# EAGLE design T&TV1.0 (EAGLE 9.3.1)

## Sheet 1 of 2
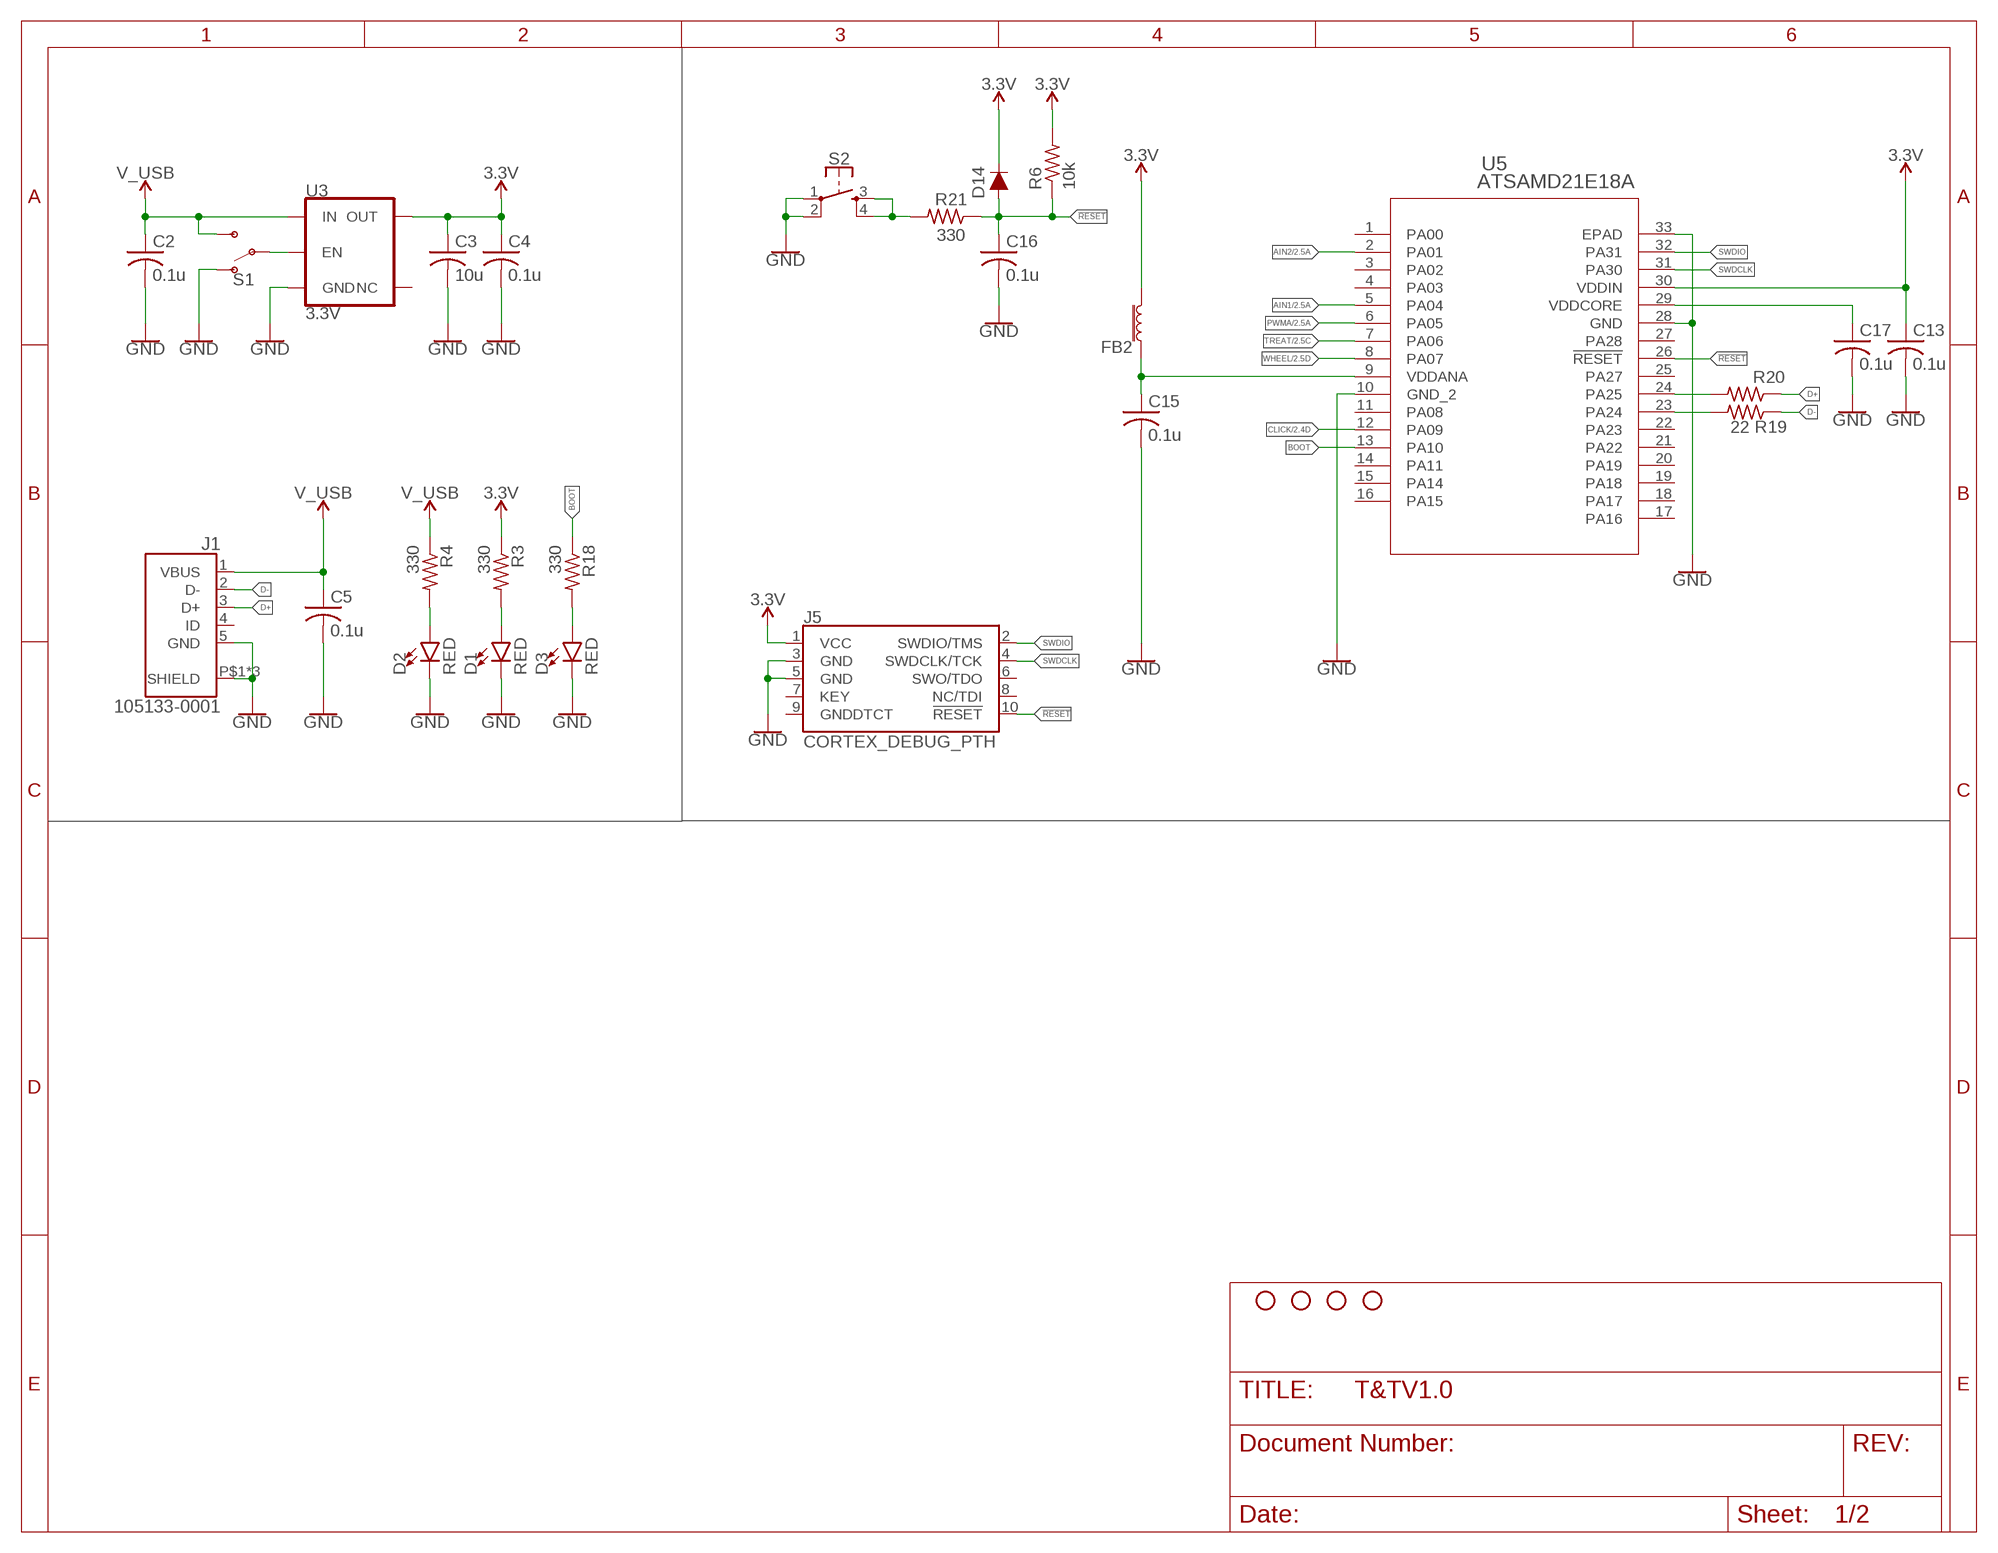
[diagram p0: schematic, sheet 1]

### Parts
C2  0.1u  C-USC0603K  [C0603K]
C3  10u  C-USC1206  [C1206]
C4  0.1u  C-USC0603K  [C0603K]
C5  0.1u  C-USC0603K  [C0603K]
C13  0.1u  C-USC0603K  [C0603K]
C15  0.1u  C-USC0603K  [C0603K]
C16  0.1u  C-USC0603K  [C0603K]
C17  0.1u  C-USC0603K  [C0603K]
D1  RED  LED-RED0603  [LED-0603]
D2  RED  LED-RED0603  [LED-0603]
D3  RED  LED-RED0603  [LED-0603]
D14  250mA/100V  DIODE-BAS16J  [SOD-323]
FB2  30Ω/1.8A  FERRITE_BEAD-0603  [0603]
H1  STAND-OFF  [STAND-OFF]
H2  STAND-OFF  [STAND-OFF]
H3  STAND-OFF  [STAND-OFF]
H4  STAND-OFF  [STAND-OFF]
J1  105133-0001  [MOLEX_105133-0001]
J5  CORTEX_DEBUG_PTH  [2X5-PTH-1.27MM]
R3  330  R-US_R0603  [R0603]
R4  330  R-US_R0603  [R0603]
R6  10k  R-US_R0603  [R0603]
R18  330  R-US_R0603  [R0603]
R19  22  R-US_R0603  [R0603]
R20  22  R-US_R0603  [R0603]
R21  330  R-US_R0603  [R0603]
S1  SWITCH-SPDT-SMD-RIGHT-ANGLE  [SWITCH_SPST_SMD_A]
S2  MOMENTARY-SWITCH-SPST-2-SMD-5.2MM  [TACTILE_SWITCH_SMD_5.2MM]
U3  3.3V  V_REG_AP2112K-3.3V  [SOT23-5]
U5  ATSAMD21E18A  ATSAMD21E18A-MUT  [QFN32_5X5MC]

### Nets
3.3V: C3.1 C4.1 C13.1 D14.C FB2.2 J5.1(VCC) R3.1 R6.2 U3.5(OUT) U5.30(VDDIN) ; also sheet 2
!RESET: C16.1 D14.A J5.10(!RESET) R6.1 R21.1 U5.26(!RESET)
AIN1: U5.5(PA04) ; also sheet 2
AIN2: U5.2(PA01) ; also sheet 2
BOOT: R18.1 U5.13(PA10)
CLICK: U5.12(PA09) ; also sheet 2
D+: J1.3(D+) R20.1
D-: J1.2(D-) R19.1
GND: C2.2 C3.2 C4.2 C5.2 C13.2 C15.2 C16.2 C17.2 D1.C D2.C D3.C J1.5(GND) J1.P$1(SHIELD) J1.P$2(SHIELD) J1.P$3(SHIELD) J5.3(GND) J5.5(GND) S1.1(O) S2.1 S2.2 U3.2(GND) U5.10(GND_2) U5.28(GND) U5.33(EPAD) ; also sheet 2
N$1: D1.A R3.2
N$4: C15.1 FB2.1 U5.9(VDDANA)
N$11: C17.1 U5.29(VDDCORE)
N$14: D2.A R4.2
N$17: D3.A R18.2
N$32: R20.2 U5.24(PA25)
N$33: R19.2 U5.23(PA24)
N$34: R21.2 S2.3 S2.4
N$35: S1.2(P) U3.3(EN)
PWMA: U5.6(PA05) ; also sheet 2
SWDCLK: J5.4(SWDCLK/TCK) U5.31(PA30)
SWDIO: J5.2(SWDIO/TMS) U5.32(PA31)
TREAT: U5.7(PA06) ; also sheet 2
V_USB: C2.1 C5.1 J1.1(VBUS) R4.1 S1.3(S) U3.1(IN) ; also sheet 2
WHEEL: U5.8(PA07) ; also sheet 2
Unconnected: J1.4(ID) J5.6(SWO/TDO) J5.7(KEY) J5.8(NC/TDI) J5.9(GNDDTCT) U3.4(NC) U5.1(PA00) U5.3(PA02) U5.4(PA03) U5.11(PA08) U5.14(PA11) U5.15(PA14) U5.16(PA15) U5.17(PA16) U5.18(PA17) U5.19(PA18) U5.20(PA19) U5.21(PA22) U5.22(PA23) U5.25(PA27) U5.27(PA28)

## Sheet 2 of 2
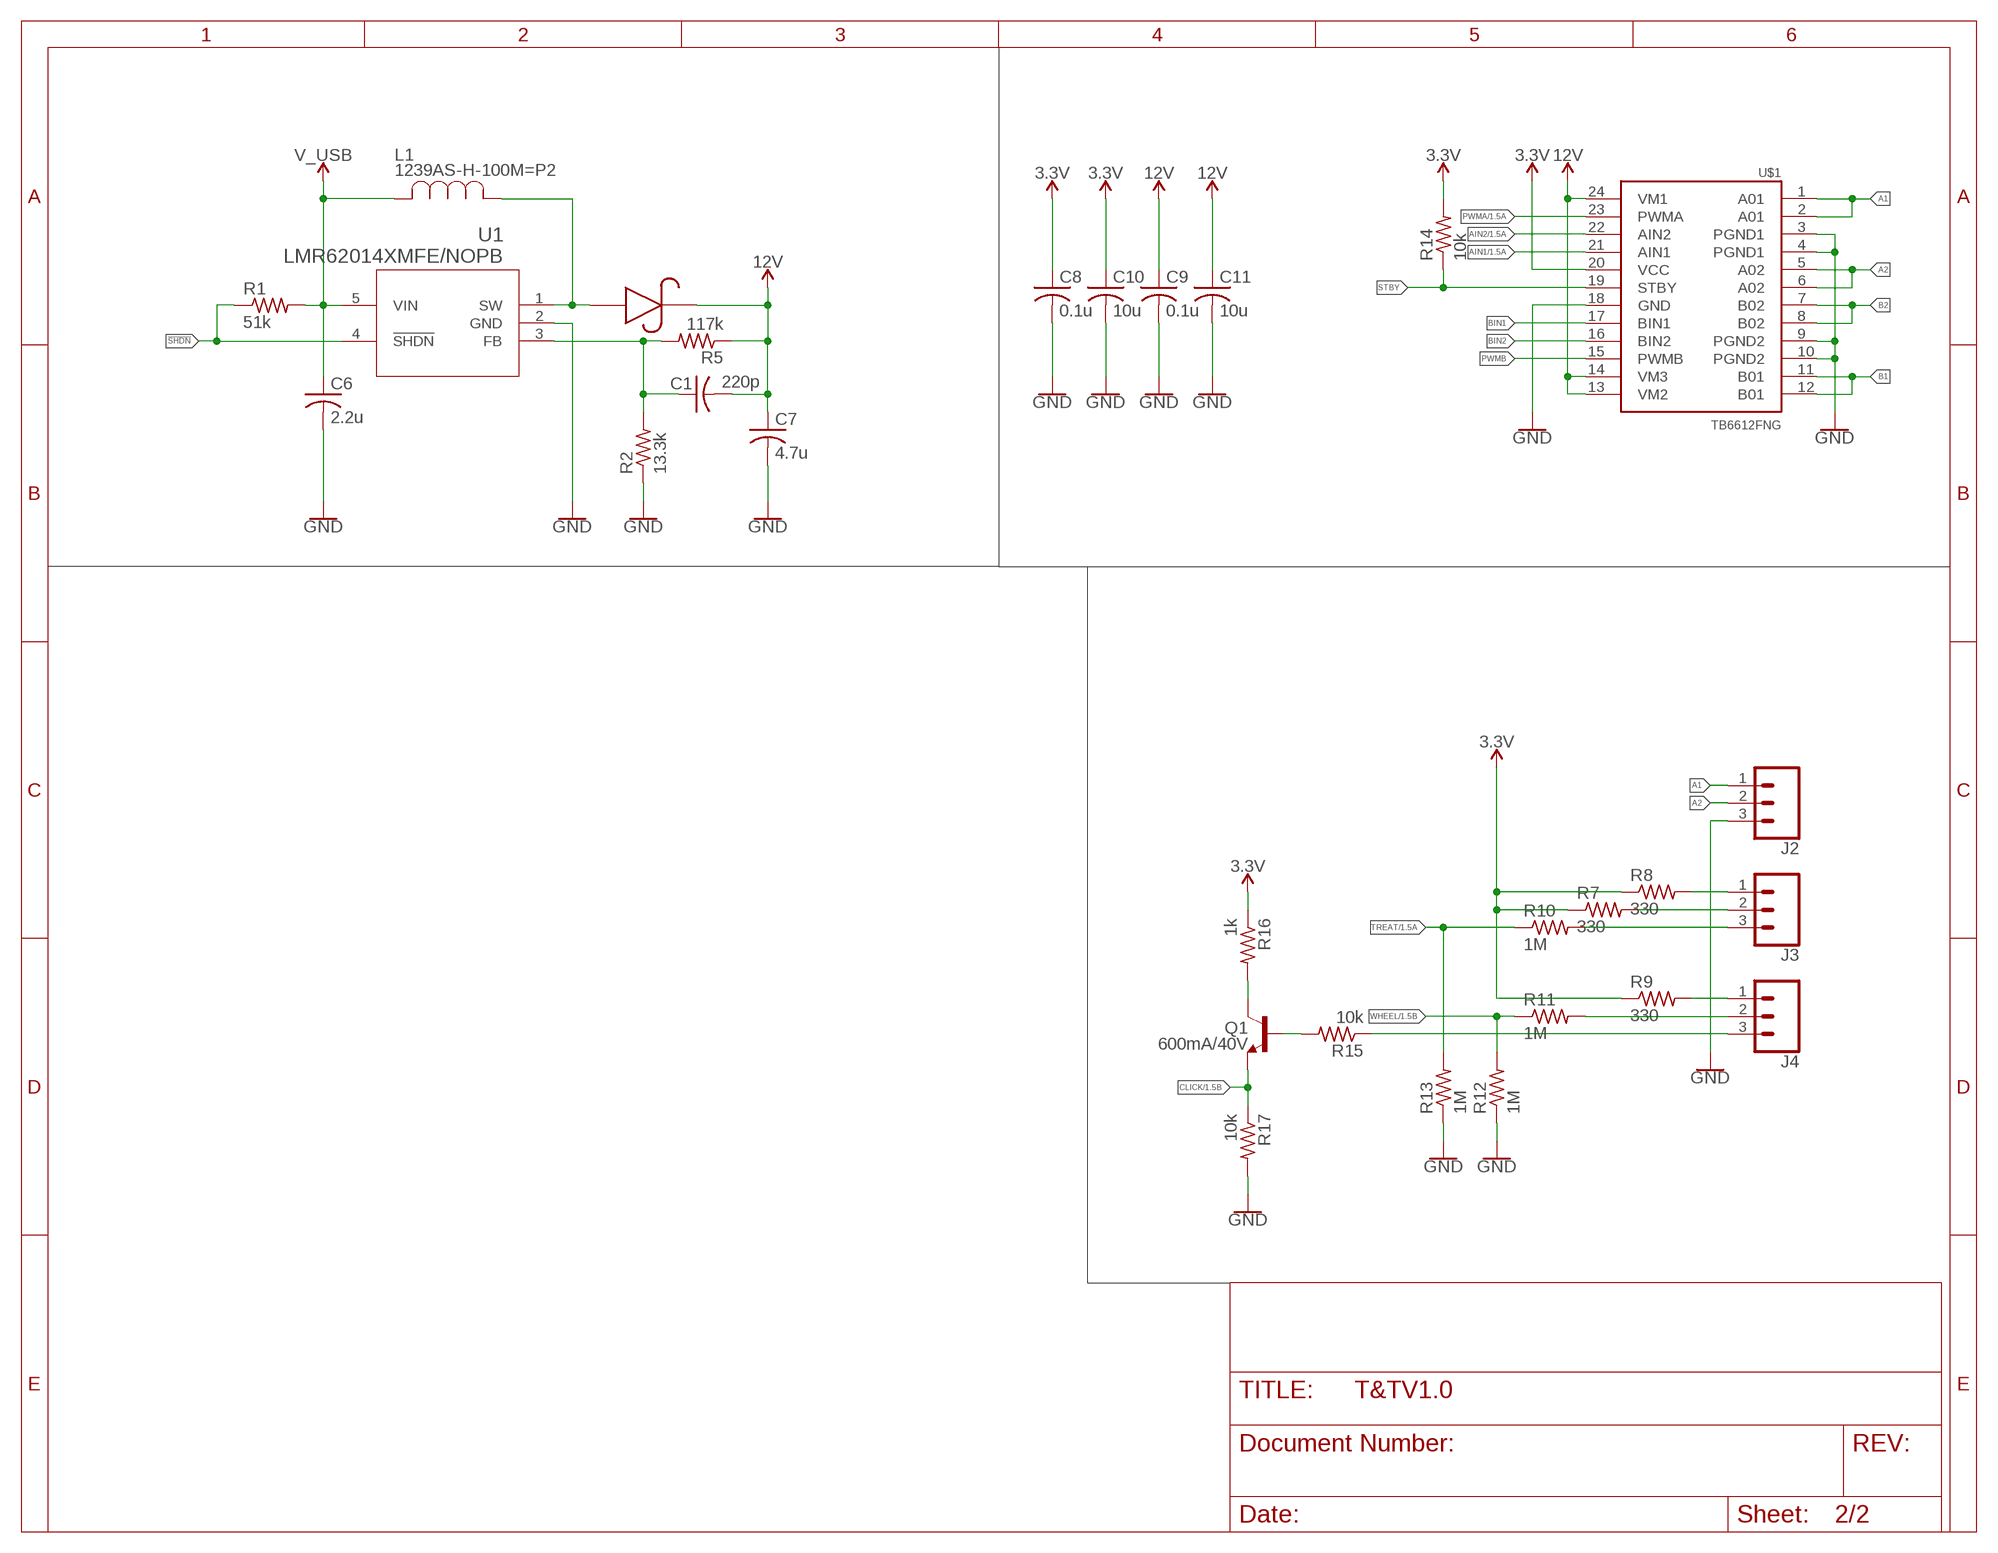
[diagram p1: schematic, sheet 2]

### Parts
C1  220p  C-USC0603  [C0603]
C6  2.2u  C-USC0603  [C0603]
C7  4.7u  C-USC0603  [C0603]
C8  0.1u  C-USC0603  [C0603]
C9  0.1u  C-USC0603  [C0603]
C10  10u  C-USC1206  [C1206]
C11  10u  C-USC1206  [C1206]
J2  CONN_03SCREW-NS  [SCREWTERMINAL-3.5MM-3-NS]
J3  CONN_03SCREW-NS  [SCREWTERMINAL-3.5MM-3-NS]
J4  CONN_03SCREW-NS  [SCREWTERMINAL-3.5MM-3-NS]
L1  1239AS-H-100M=P2  [IND_DFE252012C]
Q1  600mA/40V  TRANS_NPN-MMBT2222AL  [SOT23-3]
R1  51k  R-US_R0603  [R0603]
R2  13.3k  R-US_R0603  [R0603]
R5  117k  R-US_R0603  [R0603]
R7  330  R-US_R0603  [R0603]
R8  330  R-US_R0603  [R0603]
R9  330  R-US_R0603  [R0603]
R10  1M  R-US_R0603  [R0603]
R11  1M  R-US_R0603  [R0603]
R12  1M  R-US_R0603  [R0603]
R13  1M  R-US_R0603  [R0603]
R14  10k  R-US_R0603  [R0603]
R15  10k  R-US_R0603  [R0603]
R16  1k  R-US_R0603  [R0603]
R17  10k  R-US_R0603  [R0603]
U1  LMR62014XMFE/NOPB  [MF05A]
U4  MBR0520  MBR0520LT1G  [SOD-123]
U$1  TB6612FNG  [SSOP24]

### Nets
3.3V: C8.1 C10.1 R7.1 R8.1 R9.1 R14.2 R16.1 U$1.20(VCC) ; also sheet 1
12V: C1.2 C7.1 C9.1 C11.1 R5.1 U4.2 U$1.13(VM2) U$1.14(VM3) U$1.24(VM1)
!SHDN: R1.1 U1.4(!SHDN)
A1: J2.1 U$1.1(A01) U$1.2(A01)
A2: J2.2 U$1.5(A02) U$1.6(A02)
AIN1: U$1.21(AIN1) ; also sheet 1
AIN2: U$1.22(AIN2) ; also sheet 1
B1: U$1.11(B01) U$1.12(B01)
B2: U$1.7(B02) U$1.8(B02)
BIN1: U$1.17(BIN1)
BIN2: U$1.16(BIN2)
CLICK: Q1.2(E) R17.1 ; also sheet 1
GND: C6.2 C7.2 C8.2 C9.2 C10.2 C11.2 J2.3 R2.1 R12.1 R13.1 R17.2 U1.2(GND) U$1.3(PGND1) U$1.4(PGND1) U$1.9(PGND2) U$1.10(PGND2) U$1.18(GND) ; also sheet 1
N$2: Q1.1(B) R15.2
N$3: L1.1 U1.1(SW) U4.1
N$5: J3.1 R8.2
N$6: J3.2 R7.2
N$9: C1.1 R2.2 R5.2 U1.3(FB)
N$10: J4.1 R9.2
N$12: J3.3 R10.2
N$13: Q1.3(C) R16.2
N$15: J4.2 R11.2
N$16: J4.3 R15.1
PWMA: U$1.23(PWMA) ; also sheet 1
PWMB: U$1.15(PWMB)
STBY: R14.1 U$1.19(STBY)
TREAT: R10.1 R13.2 ; also sheet 1
V_USB: C6.1 L1.2 R1.2 U1.5(VIN) ; also sheet 1
WHEEL: R11.1 R12.2 ; also sheet 1

## Library data of the parts
C1-C11 C13 C15-C17 = adafruit:C-US: CAPACITOR, American symbol
D1-D3 = SparkFun-LED:LED-RED: Red SMD LED Used in manufacturing of most products at SparkFun Packages: 0603 - SMD 0603 package [Product Link] <http://docs.avagotech.com/docs/AV02-0551EN> 0603 SMART - SMD 0603 SMART package ( more efficient and expensive)[Product Link] <http://www.osram-os.com/Graphics/XPic2/00077099_0.pdf> 1206 - SMD1206 package [Product Link] <https://www.sparkfun.com/datasheets/DevTools/LilyPad/Q150OVS4.pdff> SparkFun Products: Pro Mini 328 -5V <https://www.sparkfun.com/products/821> RedBoard <https://www.sparkfun.com/products/12757> IOIO-OTG <https://www.sparkfun.com/products/13613>; PROD_ID: DIO-00819
D14 = SparkFun-DiscreteSemi:DIODE: Diode These are standard reverse protection diodes and small signal diodes. SparkFun Products: SparkFun SparkPunk Sound Kit <https://www.sparkfun.com/products/11177> SparkFun ESP8266 Thing <https://www.sparkfun.com/products/13231>; PROD_ID: DIO-09646
FB2 = SparkFun-Coils:FERRITE_BEAD: Ferrite Bead (blocks, cores, rings, chokes, etc.) Inductor with layers of ferrite used to suppress high frequencies. Often used to isolate high frequency noise. SparkFun Products: IOIO-OTG - V2.2 <https://www.sparkfun.com/products/13613> SparkFun SAMD21 Mini Breakout <https://www.sparkfun.com/products/13664> SparkFun 6 Degrees of Freedom Breakout - LSM6DS3 <https://www.sparkfun.com/products/13339> SparkFun SAMD21 Dev Breakout <https://www.sparkfun.com/products/13672>; PROD_ID: NDUC-13805
H1-H4 = SparkFun-Hardware:STAND-OFF: Stand Off Drill holes for mechanically mounting via screws, standoffs, etc. Note: Use the keepout ring to avoid running the screw head into surrounding components. Variant Overviews STAND-OFF - Mechanical footprint for a #4 phillips button head screw. STAND-OFF-TIGHT - Mechanical footprint for a #4 phillips button head screw, Example SparkFun Products Screw - Phillips Head (1/4", 4-40, 10 pack) <https://www.sparkfun.com/products/10453> (PRT-10453) Screw - Phillips Head (1/2", 4-40, 10 pack) <https://www.sparkfun.com/products/10452> (PRT-10452) Screw - Phillips Head (3/4", 4-40, 10 pack) <https://www.sparkfun.com/products/10451> (PRT-10451) Screw - Phillips Head (1", 4-40, 10 pack) <https://www.sparkfun.com/products/10450> (PRT-10450)
J1 = VertUSB105133-0001:105133-0001: Conn Micro USB Type B RCP 5 POS 0.65mm Solder RA SMD 5 Terminal 1 Port Embossed T/R; DESCRIPTION: USB - micro B USB 2.0 Receptacle Connector 5 Position Surface Mount; DIGI-KEY_PART_NUMBER: WM9734CT-ND; DIGI-KEY_PURCHASE_URL: https://www.digikey.com/product-detail/en/molex/1051330001/WM9734CT-ND/4037910?utm_source=snapeda&utm_medium=aggregator&utm_campaign=symbol; MF: Molex; MP: 1051330001; PACKAGE: None
J2-J4 = SparkFun-Connectors:CONN_03: Multi connection point. Often used as Generic Header-pin footprint for 0.1 inch spaced/style header connections On any of the 0.1 inch spaced packages, you can populate with these: Break Away Headers - Straight <https://www.sparkfun.com/products/116> (PRT-00116) Break Away Male Headers - Right Angle <https://www.sparkfun.com/products/553> (PRT-00553) Female Headers <https://www.sparkfun.com/products/115> (PRT-00115) Break Away Headers - Machine Pin <https://www.sparkfun.com/products/117> (PRT-00117) Break Away Female Headers - Swiss Machine Pin <https://www.sparkfun.com/products/743> (PRT-00743) Stackable Header - 3 Pin (Female, 0.1") <https://www.sparkfun.com/products/13875> (PRT-13875) For SCREWTERMINALS and SPRING TERMINALS visit here: Screw Terimnals on SparkFun.com <https://www.sparkfun.com/search/results?term=Screw+Terminals> (5mm/3.5mm/2.54mm spacing) This device is also useful as a general connection point to wire up your design to another part of your project. Our various solder wires solder well into these plated through hole pads. Hook-Up Wire - Assortment (Stranded, 22 AWG) <https://www.sparkfun.com/products/11375> (PRT-11375) Hook-Up Wire - Assortment (Solid Core, 22 AWG) <https://www.sparkfun.com/products/11367> (PRT-11367) View the entire wire category on our website here <https://www.sparkfun.com/categories/141> Special notes: Molex polarized connector foot print use with SKU : PRT-08232 with associated crimp pins and housings.
J5 = SparkFun-Connectors:CORTEX_DEBUG: Cortex Debug Connector - 10 pin Supports JTAG debug, Serial Wire debug, and Serial Wire Viewer. PTH and SMD connector options available. General Connector Information <http://infocenter.arm.com/help/topic/com.arm.doc.faqs/attached/13634/cortex_debug_connectors.pdf> Products: PTH Connector <http://www.digikey.com/product-detail/en/cnc-tech/3220-10-0100-00/1175-1627-ND/3883661> -via Digi-Key SparkFun PSoc <https://www.sparkfun.com/products/13229> SparkFun T <https://www.sparkfun.com/products/13810>
L1 = 1239AS-H-100M=P2:1239AS-H-100M=P2; BUILT_BY: EMA_Justin; COPYRIGHT: Copyright (C) 2016 Accelerated Designs. All rights reserved; MANUFACTURER_PART_NUMBER: 1239AS-H-100M=P2; VENDOR: Murata
Q1 = SparkFun-DiscreteSemi:TRANS_NPN: NPN transistor Current controlled devices typically used to amplify current or used as a switch. BC547 - COM-08928 <http://www.sparkfun.com/products/8928> (TO-92 45V 100mA) (1.Collector 2.Base 3.Emitter) 2N3904 - COM-00521 <http://www.sparkfun.com/products/521> (TO-92 40V 200mA) (1.Emitter 2.Base 3.Collector) P2N2222A - COM-12852 <http://www.sparkfun.com/products/12852> (TO-92 40V 600mA) (1.Collector 2.Base 3.Emitter); PROD_ID: TRANS-08049
R1-R21 = adafruit:R-US_: RESISTOR, American symbol
S1 = SparkFun-Switches:SWITCH-SPDT: Single Pole, Double Throw (SPDT) Switch Single-pole, double-throw (SPDT) switch. Variant Overview SMD-AYZ0202 Surface Mount DPDT Switch <https://www.sparkfun.com/products/597> (COM-00597) Used on e.g. LilyPad Arduino USB - ATmega32U4 Board <https://www.sparkfun.com/products/12049> PTH-11.6X4.0MM SPDT Mini Power Switch <https://www.sparkfun.com/products/102> (COM-00102) Used on e.g. SparkFun Simon Says - Through-Hole Soldering Kit <https://www.sparkfun.com/products/10547> (KIT-10547) PTH-11.6X4.0MM-KIT KIT version of SPDT Mini Power Switch - Simplifies soldering by removing tStop of switch pins - only one side can be soldered. PTH-11.6X4.0MM-LOCK LOCK version of SPDT Mini Power Switch - Offset pins hold switch in place for easier soldering. SMD-RIGHT-ANGLE Surface Mount Right Angle Switch <https://www.sparkfun.com/products/10860> (COM-10860) Used on e.g. SparkFun ESP8266 Thing <https://www.sparkfun.com/products/13231>; PROD_ID: SWCH-10651; SF_SKU: COM-10860
S2 = SparkFun-Switches:MOMENTARY-SWITCH-SPST-2: Momentary Switch (Pushbutton) - SPST - Two Circuits Normally-open (NO) SPST momentary switches (buttons, pushbuttons). Schematic symbol includes two switch circuits. Variants SMD-4.6MMX2.8MM - 4.60mm x 2.80mm Tactile Momentary Button Switch - Used on SparkFun SAMD21 Mini Breakout <https://www.sparkfun.com/products/13664> SMD-5.2MM - Mini Pushbutton Switch - SMD <https://www.sparkfun.com/products/8720> - Used on Arduino Pro Mini <https://www.sparkfun.com/products/11114>; PROD_ID: SWCH-08247; SF_SKU: COM-08720
U1 = LMR62014:LMR62014XMFE/NOPB; BUILT_BY: EMA_UL_Team; MANUFACTURER: Texas Instruments; MANUFACTURER_PART_NUMBER: LMR62014XMFE/NOPB; VENDOR: National Semiconductor
U3 = SparkFun-IC-Power:V_REG_AP2112: AP2112 - 600mA CMOS LDO Regulator w/ Enable The AP2112 is CMOS process low dropout linear regulator with enable function, the regulator delivers a guaranteed 600mA (min.) continuous load current. Features Output Voltage Accuracy: ±1.5% Output Current: 600mA (Min.) Foldback Short Current Protection: 50mA Enable Function to Turn ON/OFF VOUT Low Dropout Voltage (3.3V): 250mV (Typ.) @IOUT=600mA Excellent Load Regulation: 0.2%/A (Typ.) Excellent Line Regulation: 0.02%/V (Typ.) Low Quiescent Current: 55μA (Typ.) Low Standby Current: 0.01μA (Typ.) Low Output Noise: 50μVRMS PSRR: 100Hz -65dB, 1kHz -65dB OTSD Protection Stable with 1.0μF Flexible Cap: Ceramic, Tantalum and Aluminum Electrolytic Operation Temperature Range: -40°C to 85°C ESD: MM 400V, HBM 4000V; PROD_ID: VREG-12457
U4 = MBR0520LT1G:MBR0520LT1G; BUILT_BY: EMA_UL_Team; MANUFACTURER_PART_NUMBER: MBR0520LT1G; VENDOR: ON Semiconductor
U5 = ATSAMD21E18A-MUT:ATSAMD21E18A-MUT; BUILT_BY: EMA_Molly; COPYRIGHT: Copyright (C) 2018 Accelerated Designs. All rights reserved; MANUFACTURER_PART_NUMBER: ATSAMD21E18A-MUT; VENDOR: Microchip
U$1 = SparkFun-IC-Special-Function:TB6612FNG: Toshiba 1A dual motor driver IC-09363; PROD_ID: IC-09363

## Board
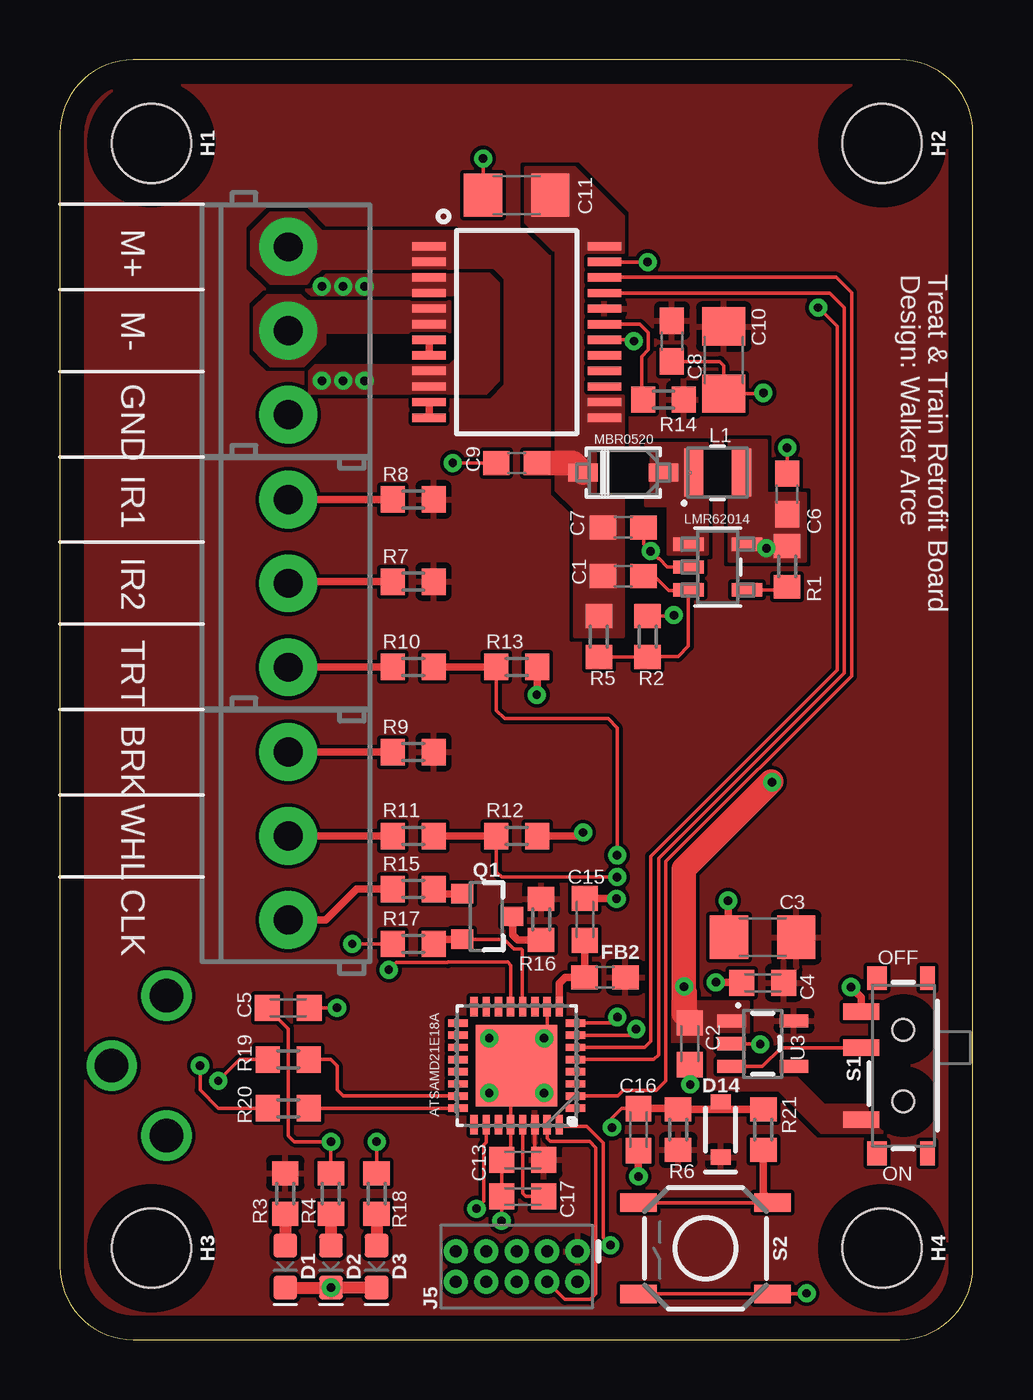
[diagram p2: board, top side]
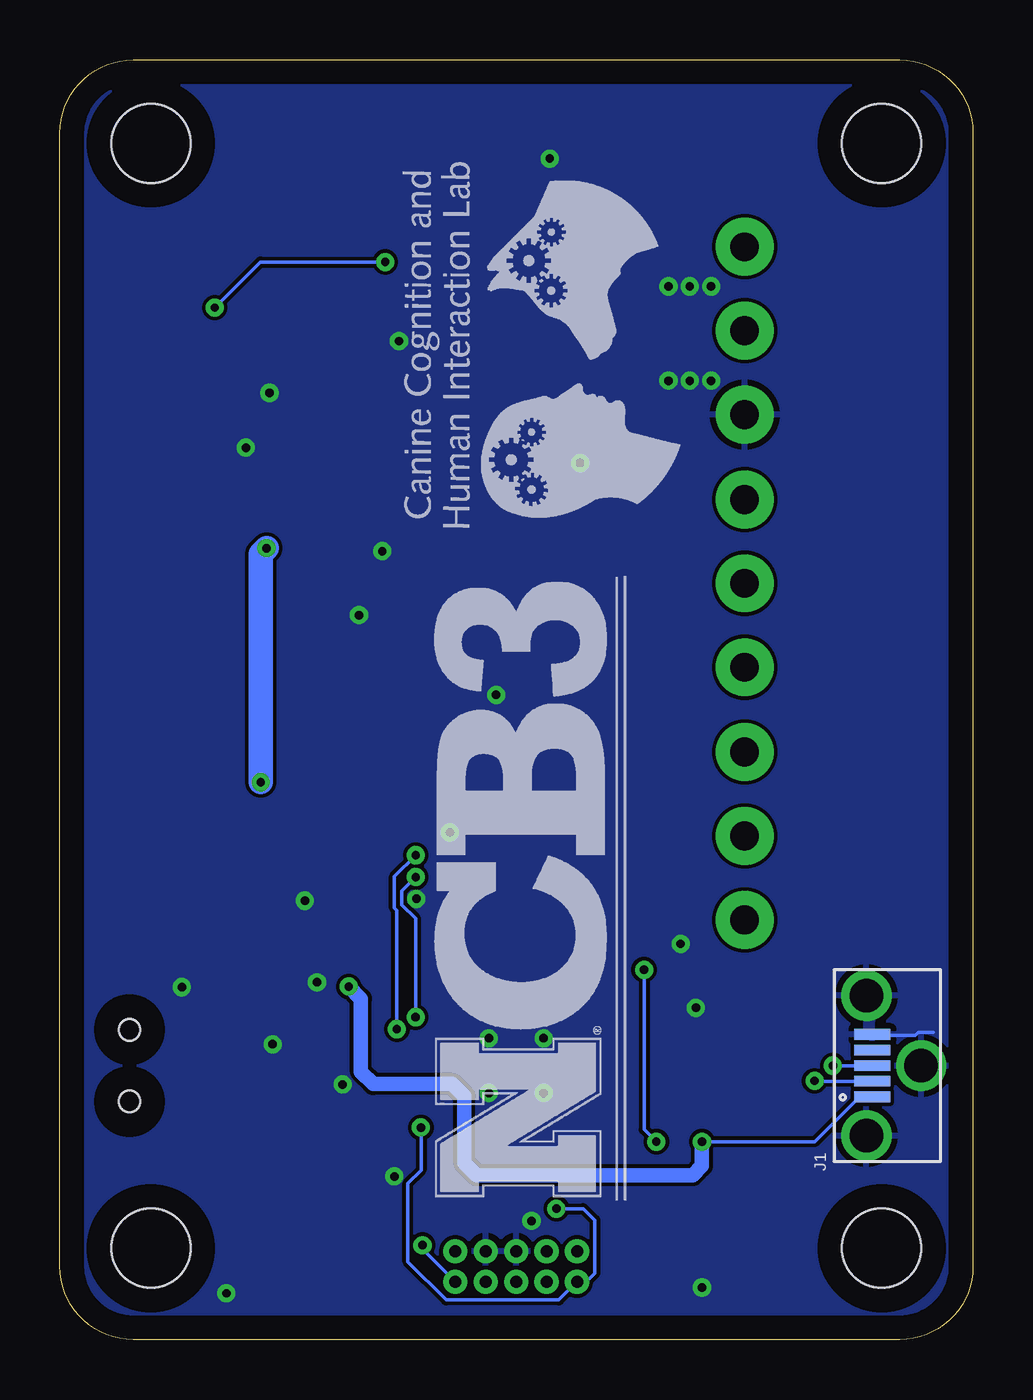
[diagram p3: board, bottom side, seen from below]

Size 38.08 x 53.39 mm. Coordinates in mm from the lower left corner, seen from the top.
Outline: 0,50.34 0,3.05 arc90 3.05,0 35.03,0 arc90 38.08,3.05 38.08,50.34 arc90 35.03,53.39 3.05,53.39 arc90 0,50.34
Copper layers (1*16): Top 0.035mm / dielectric 1.5mm / Bottom 0.035mm
Design rules "default": minimum track width 6mil, minimum drill 0.35mm, track to track 6mil, track to pad 6mil, pad to pad 6mil, via to via 6mil, smd to smd 6mil, copper to edge 40mil, drill to drill 6mil, minimum pad ring 10mil, minimum via ring 8mil, stop-mask expansion 4mil, vias tented up to drill 0mil, thermal gap 10mil

### Footprints (pad centres in the part's own frame; a part is rotated, then mirrored left to right if it is on the bottom)
C0603 = smd 1.1 x 1: 1 -0.85,0; 2 0.85,0
C0603K = smd 1.05 x 1.08: 1 -0.875,0; 2 0.875,0
C1206 = smd 1.6 x 1.8: 1 -1.4,0; 2 1.4,0
LED-0603 = smd 1 x 1: A -0.877,0; C 0.877,0
SOD-323 = smd 0.63 x 0.83: A 1.15,0; C -1.15,0
0603 = smd 1.1 x 1: 1 -0.85,0; 2 0.85,0
STAND-OFF = hole 3.302: 0,0
MOLEX_105133-0001 = smd 0.45 x 1.5: 1 -1.3,-0.25; 2 -0.65,-0.25; 3 0,-0.25; 4 0.65,-0.25; 5 1.3,-0.25 | drill 1.4: P$1 0,-2.286; P$2 -2.921,0; P$3 2.921,0
SCREWTERMINAL-3.5MM-3-NS = drill 1.2 pad 2.413: 1 0,0; 2 3.5,0; 3 7,0
2X5-PTH-1.27MM = drill 0.508 pad 1: 1 -2.54,-0.635; 2 -2.54,0.635; 3 -1.27,-0.635; 4 -1.27,0.635; 5 0,-0.635; 6 0,0.635; 7 1.27,-0.635; 8 1.27,0.635; 9 2.54,-0.635; 10 2.54,0.635
IND_DFE252012C = smd 0.8 x 2.007: 1 -0.997,0; 2 0.997,0
SOT23-3 = smd 0.8 x 0.9: 1 -0.95,-1; 2 0.95,-1; 3 0,1.1
R0603 = smd 1 x 1.1: 1 -0.85,0; 2 0.85,0
SWITCH_SPST_SMD_A = smd 0.7 x 1.5: 1 -2.25,-1.75; 2 -0.75,-1.75; 3 2.25,-1.75 | smd 1 x 0.6: GND1 -3.65,1; GND3 3.65,1 | smd 1 x 0.8: GND2 -3.65,-1.1; GND4 3.65,-1.1 | hole 0.9: -1.5,0; 1.5,0
TACTILE_SWITCH_SMD_5.2MM = smd 1.524 x 0.762: 1 -2.794,1.905; 2 2.794,1.905; 3 -2.794,-1.905; 4 2.794,-1.905
MF05A = smd 1.27 x 0.559: 1 -1.219,0.953; 2 -1.219,0; 3 -1.219,-0.953; 4 1.219,-0.953; 5 1.219,0.953
SOT23-5 = smd 0.55 x 1.2: 1 -0.95,-1.3; 2 0,-1.3; 3 0.95,-1.3; 4 0.95,1.3; 5 -0.95,1.3
SOD-123 = smd 1.219 x 0.762: 1 -1.676,0; 2 1.676,0
QFN32_5X5MC = smd 0.813 x 0.305: 1 -2.451,1.778; 2 -2.451,1.27; 3 -2.451,0.762; 4 -2.451,0.254; 5 -2.451,-0.254; 6 -2.451,-0.762; 7 -2.451,-1.27; 8 -2.451,-1.778; 17 2.451,-1.778; 18 2.451,-1.27; 19 2.451,-0.762; 20 2.451,-0.254; 21 2.451,0.254; 22 2.451,0.762; 23 2.451,1.27; 24 2.451,1.778 | smd 0.305 x 0.813: 9 -1.778,-2.451; 10 -1.27,-2.451; 11 -0.762,-2.451; 12 -0.254,-2.451; 13 0.254,-2.451; 14 0.762,-2.451; 15 1.27,-2.451; 16 1.778,-2.451; 25 1.778,2.451; 26 1.27,2.451; 27 0.762,2.451; 28 0.254,2.451; 29 -0.254,2.451; 30 -0.762,2.451; 31 -1.27,2.451; 32 -1.778,2.451 | smd 3.404 x 3.404: 33 0,0
SSOP24 = smd 0.348 x 1.397: 1 -3.575,-3.656; 2 -2.925,-3.656; 3 -2.275,-3.656; 4 -1.625,-3.656; 5 -0.975,-3.656; 6 -0.325,-3.656; 7 0.325,-3.656; 8 0.975,-3.656; 9 1.625,-3.656; 10 2.275,-3.656; 11 2.925,-3.656; 12 3.575,-3.656; 13 3.575,3.656; 14 2.925,3.656; 15 2.275,3.656; 16 1.625,3.656; 17 0.975,3.656; 18 0.325,3.656; 19 -0.325,3.656; 20 -0.975,3.656; 21 -1.625,3.656; 22 -2.275,3.656; 23 -2.925,3.656; 24 -3.575,3.656

### Placement (x,y rotation side)
C1  23.5,31.85 180 top
C2  26.26,12.34 270 top
C3  29.31,16.79 180 top
C4  29.31,14.88 180 top
C5  9.53,13.84 0 top
C6  30.33,35.28 90 top
C7  23.5,33.88 0 top
C8  25.53,41.66 270 top
C9  19.05,36.58 180 top
C10  27.69,40.87 270 top
C11  19.05,47.75 180 top
C13  19.3,7.49 180 top
C15  21.89,17.53 90 top
C16  24.13,8.76 270 top
C17  19.3,5.97 180 top
D1  9.4,3.05 270 top
D2  11.3,3.05 270 top
D3  13.21,3.05 270 top
D14  27.56,8.76 90 top
FB2  22.73,15.11 0 top
H1  3.81,49.91 270 top
H2  34.29,49.91 270 top
H3  3.81,3.81 270 top
H4  34.29,3.81 270 top
J1  4.45,11.43 90 bottom
J2  9.53,45.59 270 top
J3  9.53,35.05 270 top
J4  9.53,24.51 270 top
J5  19.05,3.05 180 top
L1  27.43,36.17 0 top
Q1  17.78,17.65 270 top
R1  30.33,32.26 90 top
R2  24.51,29.34 270 top
R3  9.4,6.1 270 top
R4  11.3,6.1 270 top
R5  22.48,29.34 270 top
R6  25.78,8.76 270 top
R7  14.73,31.62 180 top
R8  14.73,35.05 180 top
R9  14.73,24.51 180 top
R10  14.73,28.07 180 top
R11  14.73,21.01 180 top
R12  19.05,21.01 180 top
R13  19.05,28.07 180 top
R14  25.17,39.22 0 top
R15  14.73,18.8 0 top
R16  20.07,17.53 270 top
R17  14.73,16.51 180 top
R18  13.21,6.1 270 top
R19  9.53,11.68 0 top
R20  9.53,9.65 0 top
R21  29.34,8.76 270 top
S1  35.18,11.43 270 top
S2  26.92,3.81 180 top
U1  27.43,32.23 0 top
U3  29.31,12.34 270 top
U4  23.5,36.17 180 top
U5  19.05,11.43 180 top
U$1  19.05,42.04 270 top

### Tracks (layer width: path | path; a pad name or v marks a point on that pad's centre or on a via)
3.3V
  Top 0.152: U5.30 19.81,7.86 C13.1
  pour Top (rank 3): 0,53.34 0,0 38.1,0 38.1,53.34
12V
  Top 1.016: C9.1 21.41,36.58 U4.2
  pour Top (no thermals): 23.5,29.34 21.46,29.34 21.46,34.67 20.7,35.43 20.7,45.97 23.5,45.97 23.5,45.34 21.84,45.34 21.84,39.37 23.5,39.37
  pour Top (no thermals): 19.43,48.9 19.43,46.61 20.57,45.47 23.5,45.47 23.5,46.86 21.46,48.9
!RESET  (via drill 0.35)
  Top 0.152: U5.26 17.78,8.23 17.68,8.13 17.68,5.76 v17.37,5.46 | v23.02,8.85 23.02,9.23 23.43,9.64 C16.1
  Top 0.305: C16.1 25.78,9.64 R6.1 27.56,9.61 | 27.56,9.61 R21.1 | D14.A 27.56,9.61
  Bottom 0.152: v17.37,5.46 16.26,5.46 15.77,4.98 15.77,2.77 16.13,2.41 J5.10 17.27,1.65 21.97,1.65 23.57,3.25 23.57,6.51 23.02,7.06 v23.02,8.84 v23.02,8.85
!SHDN
  Top 0.152: U1.4 30.2,31.28 R1.1
A1
  pour Top (no thermals): 10.16,46.99 8.76,46.99 8,46.23 8,44.83 8.76,44.07 10.29,44.07 10.92,44.7 16.38,44.7 16.38,46.23 10.92,46.23
A2
  pour Top (no thermals): 16.26,43.31 10.29,43.31 10.03,43.56 9.02,43.56 8.64,43.56 8.13,43.05 8.13,41.27 8.51,40.89 8.76,40.64 10.16,40.64 11.05,41.53 11.05,41.91 11.05,42.04 16.26,42.04
AIN1
  Top 0.152: U5.5 24.77,11.68 24.97,11.89 24.97,20.07 32.72,27.81 32.72,43.05 32.11,43.66 U$1.21
AIN2
  Top 0.152: U5.2 23.26,10.16 23.5,10.39 24.87,10.39 25.27,10.79 25.27,19.94 33.02,27.69 33.02,43.69 32.38,44.32 22.72,44.32 U$1.22
B1
  Top 0.305: U$1.11 U$1.12
B2
  Top 0.305: U$1.7 U$1.8
BOOT  (via drill 0.35)
  Top 0.152: U5.13 18.8,15.62 18.67,15.75 16.19,15.75 16.18,15.73 14.02,15.73 v13.72,15.43 | v13.21,8.26 R18.1
  Bottom 0.152: v13.72,15.43 13.72,8.76 v13.21,8.26
CLICK
  Top 0.152: Q1.2 18.52,16.7 18.93,16.3 19.25,16.3 19.29,16.26 19.29,13.9 U5.12
  Top 0.305: Q1.2 15.78,16.7 R17.1
D+  (via drill 0.35)
  Top 0.152: v5.84,11.43 5.84,10.41 6.6,9.65 R20.1
  Bottom 0.152: J1.3 v5.84,11.43
D-  (via drill 0.35)
  Top 0.152: v6.6,10.79 7.49,11.68 R19.1
  Bottom 0.152: J1.2 v6.59,10.78 v6.6,10.79
GND  (via drill 0.35)
  Top 0.152: S2.2 S2.1 31.11,1.91 v31.14,1.93 | v18.41,4.95 18.43,4.97 C17.2 C13.2 18.8,7.86 U5.28 18.8,11.18 U5.33 v20.19,12.57 20.32,12.7 U5.10 | C5.2 v11.56,13.84 | C6.2 v30.33,37.21 | C7.2 24.34,33.19 v24.64,32.89 24.95,32.58 24.99,32.58 25.34,32.23 U1.2 | R2.1 25.57,30.19 v25.61,30.23 | U$1.18 23.88,41.71 v23.94,41.66 | R17.2 v12.19,16.51 | C2.2 26.29,11.44 v26.29,10.64 | U3.2 29.18,12.34 v29.21,12.32 | C11.2 v17.65,49.27 v17.65,49.28 | C8.2 27.52,40.81 27.69,40.64 C10.2 29.31,39.47 v29.34,39.5 | C9.2 v16.38,36.58
  Top 0.305: C15.2 v23.22,18.4 v23.22,18.39 | R12.1 21.67,21.01 v21.82,21.16 | R13.1 v19.9,26.91 v19.89,26.9 | v27.86,18.31 27.86,16.84 C3.2 | C4.2 28.41,14.91 v27.36,14.91 | S1.1 33.43,14.27 v32.99,14.71 | C16.2 v24.13,6.81
  Top 0.508: D1.C D2.C D3.C
  Bottom 0.152: 1.66,12.82 1.65,12.83 2.29,12.83 2.41,12.7 4.17,12.7 J1.5
  other vias: 11.3,2.17 10.92,43.94 12.7,43.94 11.81,43.94 10.92,40.01 11.81,40.01 12.7,40.01 17.91,12.57 20.19,10.29 17.91,10.29
  pour Bottom (rank 3): 38.1,53.34 38.1,0 0,0 0,53.34
  pour Top (rank 2, no thermals): 17.91,44.45 10.29,44.45 10.29,43.43 16.38,43.43 16.51,43.31 16.51,40.89 16.26,40.64 10.41,40.64 10.41,39.5 17.78,39.5 18.29,40.01 18.29,44.07
N$1
  Top 0.508: R3.2 D1.A
N$2
  Top 0.305: R15.2 15.78,18.6 Q1.1
N$3
  pour Top (no thermals): 25.7,32.77 27,32.77 27,37.39 24.46,37.39 24.43,37.36 24.43,34.8 25.37,34.8 25.37,32.77 25.68,32.77
N$4
  Top 0.305: U5.9 20.83,14.86 21.08,15.11 FB2.1 21.88,16.64 C15.1
N$5
  Top 0.305: J3.1 R8.2
N$6
  Top 0.305: J3.2 9.6,31.62 R7.2
N$9
  Top 0.152: U1.3 26.21,31.24 | 26.21,31.24 26.21,28.93 25.78,28.5 24.52,28.5 R2.2 R5.2 | C1.1 24.79,31.85 25.4,31.24 26.21,31.24
N$10
  Top 0.305: J4.1 R9.2
N$11
  Top 0.152: C17.1 19.43,5.97 19.3,6.1 U5.29
N$12
  Top 0.305: J3.3 13.87,28.05 R10.2
N$13
  Top 0.305: Q1.3 18.88,16.88 19.09,16.68 R16.2
N$14
  Top 0.508: R4.2 D2.A
N$15
  Top 0.305: J4.2 R11.2
N$16
  Top 0.305: J4.3 11.09,17.51 12.37,18.8 R15.1
N$17
  Top 0.508: R18.2 D3.A
N$32
  Top 0.152: R20.2 U5.24
N$33
  Top 0.152: R19.2 11.3,11.68 11.56,11.43 11.56,10.41 11.81,10.16 U5.23
N$34
  Top 0.152: S2.4 S2.3
  Top 0.305: R21.2 29.34,6.1 S2.3
N$35
  Top 0.152: S1.2 30.09,12.18 29.3,11.39 U3.3
PWMA  (via drill 0.35)
  Top 0.152: U5.6 24.38,12.19 24.64,12.45 24.64,20.17 32.41,27.94 32.41,42.29 31.64,43.07 v31.62,43.05 | v24.51,44.96 U$1.23
  Bottom 0.152: v31.62,43.05 29.72,44.96 v24.51,44.96
STBY
  Top 0.152: U$1.19 24.19,42.36 24.55,42 24.55,41.31 24.26,41.02 24.26,39.28 R14.1
SWDCLK
  Top 0.152: U5.31 20.32,8.39 20.45,8.26 22.09,8.26 22.35,8 22.35,1.91 22.12,1.68 21.06,1.68 J5.4
SWDIO  (via drill 0.35)
  Top 0.152: U5.32 20.92,8.89 21.97,8.89 22.66,8.2 22.66,4.24 v22.96,3.94
  Bottom 0.152: v22.96,3.94 22.96,3.78 J5.2
TREAT  (via drill 0.35)
  Top 0.152: U5.7 23.78,12.7 v24.03,12.95 | R13.2 18.2,26.25 18.54,25.91 22.86,25.91 23.24,25.53 v23.24,20.21
  Top 0.305: R10.1 R13.2
  Bottom 0.152: v24.03,12.95 24.03,17.92 24.13,18.01 24.13,19.32 v23.24,20.21
V_USB  (via drill 0.35)
  Top 0.152: R4.1 v11.3,8.26 9.78,8.26 9.53,8.51 9.53,12.97 C5.1
  Top 0.305: v29.7,23.26 29.67,23.29
  Top 0.61: v26.04,14.73 26.26,14.5 C2.1
  Top 1.016: C2.1 26.26,13.36 26.01,13.61 26.01,19.63 29.67,23.29
  Bottom 0.152: v11.3,8.26 6.6,8.26 4.73,10.13 J1.1
  Bottom 0.61: v11.3,8.26 11.3,7.24 11.68,6.86 20.7,6.86 21.21,7.37 21.21,10.16 21.72,10.67 25.02,10.67 25.53,11.18 25.53,14.22 v26.04,14.73
  Bottom 1.016: v29.7,23.26 29.7,32.78 v29.46,33.02
  pour Top (no thermals): 31.04,32.49 27.91,32.49 27.91,37.52 29.46,37.52 29.46,35.33 29.49,35.31 31.09,35.31 31.09,32.49
  pour Top (no thermals): 25.53,14.1 25.53,12.45 26.67,12.45 26.92,12.19 26.92,10.79 26.92,10.54 27.05,10.41 29.97,10.41 31.75,8.64 34.29,8.64 34.29,9.78 31.88,9.78 30.73,10.92 27.43,10.92 27.3,11.05 27.3,12.7 27.43,12.83 28.7,12.83 28.7,14.1
WHEEL  (via drill 0.35)
  Top 0.152: U5.8 23,13.21 v23.25,13.46 | R12.2 18.2,19.52 18.42,19.3 v23.24,19.3
  Top 0.305: R11.1 R12.2
  Bottom 0.152: v23.25,13.46 23.25,17.56 23.82,18.14 23.82,18.72 v23.24,19.3

### Text on the board
tPlace: M+ | Design: Walker Arce | Treat & Train Retrofit Board | M- | GND | IR1 | LMR62014 | IR2 | TRT | BRK | WHL | CLK | OFF | ON